# Altium schematic sheet IO_Connectors.SchDoc
size A4
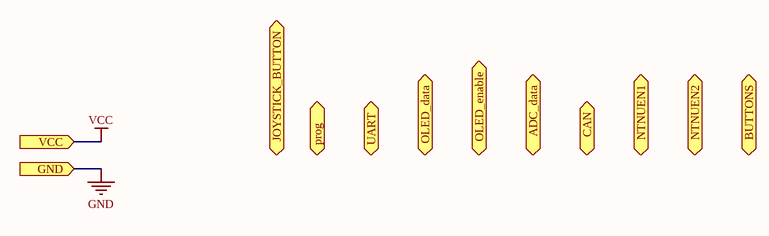
[diagram p0: IO_Connectors.SchDoc]

## Ports
ADC_data (in), BUTTONS (out), CAN (in), GND (in), JOYSTICK_BUTTON (out), NTNUEN1 (in), NTNUEN2 (in), OLED_data (in), OLED_enable (in), prog (in), UART (in), VCC (in)

## Nets
GND: port GND
VCC: port VCC